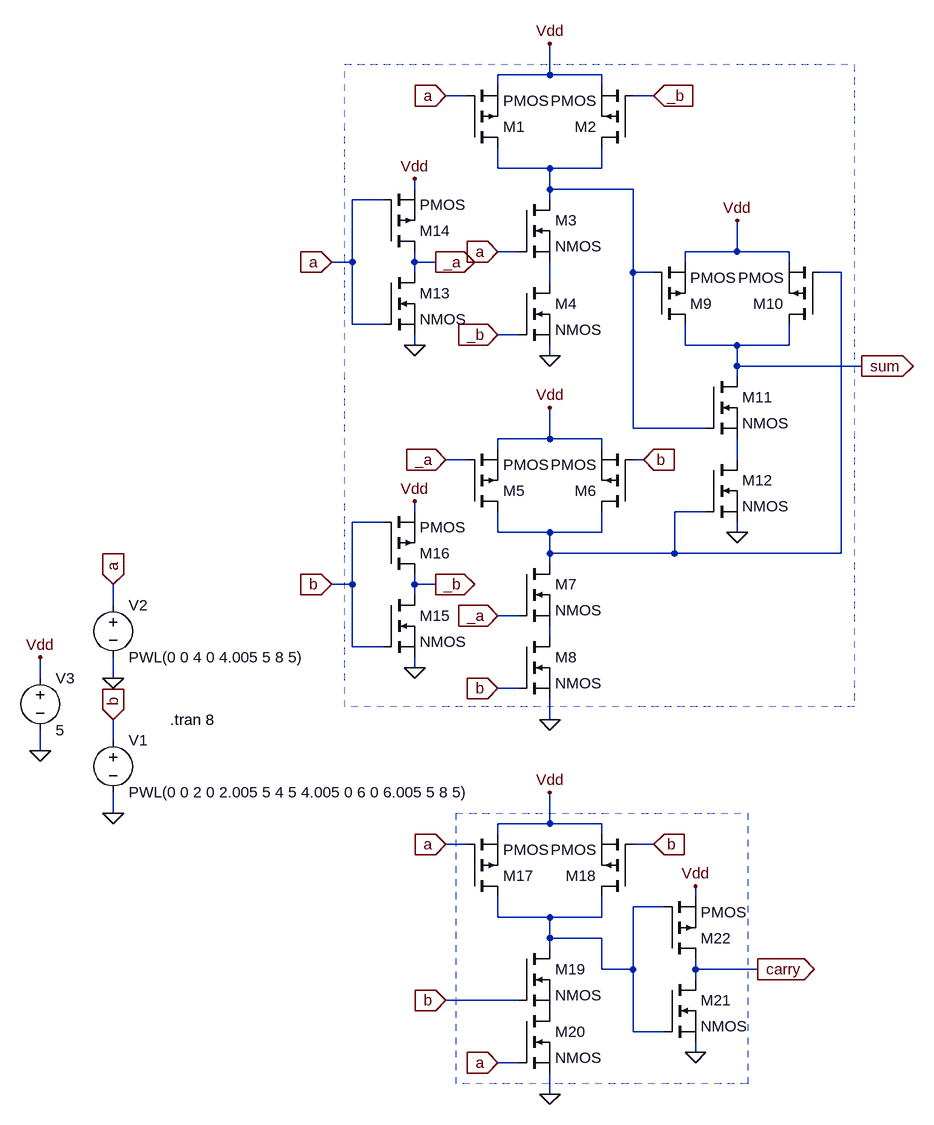
[diagram p0: schematic Half ADDER.asc]
Half ADDER.asc, the LTspice schematic file:
Version 4
SHEET 1 1216 1644
WIRE 304 -208 304 -256
WIRE 304 -208 224 -208
WIRE 384 -208 304 -208
WIRE 224 -192 224 -208
WIRE 384 -192 384 -208
WIRE 176 -176 144 -176
WIRE 464 -176 432 -176
WIRE 224 -64 224 -96
WIRE 304 -64 224 -64
WIRE 384 -64 384 -96
WIRE 384 -64 304 -64
WIRE 96 -32 96 -48
WIRE 304 -32 304 -64
WIRE 432 -32 304 -32
WIRE 48 -16 0 -16
WIRE 304 -16 304 -32
WIRE 256 64 224 64
WIRE 592 64 592 16
WIRE 592 64 512 64
WIRE 672 64 592 64
WIRE 0 80 0 -16
WIRE 0 80 -32 80
WIRE 96 80 96 64
WIRE 128 80 96 80
WIRE 512 80 512 64
WIRE 672 80 672 64
WIRE 96 96 96 80
WIRE 432 96 432 -32
WIRE 464 96 432 96
WIRE 752 96 720 96
WIRE 304 112 304 80
WIRE 0 176 0 80
WIRE 48 176 0 176
WIRE 256 192 224 192
WIRE 96 208 96 192
WIRE 512 208 512 176
WIRE 592 208 512 208
WIRE 672 208 672 176
WIRE 672 208 592 208
WIRE 304 224 304 208
WIRE 592 240 592 208
WIRE 784 240 592 240
WIRE 592 256 592 240
WIRE 432 336 432 96
WIRE 544 336 432 336
WIRE 304 352 304 304
WIRE 304 352 224 352
WIRE 384 352 304 352
WIRE 224 368 224 352
WIRE 384 368 384 352
WIRE 176 384 144 384
WIRE 448 384 432 384
WIRE 592 384 592 352
WIRE 96 464 96 448
WIRE 544 464 496 464
WIRE 48 480 0 480
WIRE 224 496 224 464
WIRE 304 496 224 496
WIRE 384 496 384 464
WIRE 384 496 304 496
WIRE 592 496 592 480
WIRE 304 528 304 496
WIRE 496 528 496 464
WIRE 496 528 304 528
WIRE 752 528 752 96
WIRE 752 528 496 528
WIRE 304 544 304 528
WIRE 0 576 0 480
WIRE 0 576 -32 576
WIRE 96 576 96 560
WIRE 128 576 96 576
WIRE 96 592 96 576
WIRE -368 608 -368 576
WIRE 256 624 224 624
WIRE 304 656 304 640
WIRE 0 672 0 576
WIRE 48 672 0 672
WIRE 96 704 96 688
WIRE -480 720 -480 688
WIRE -368 720 -368 688
WIRE 256 736 224 736
WIRE 304 784 304 752
WIRE -368 816 -368 784
WIRE -480 832 -480 800
WIRE -368 928 -368 896
WIRE 304 944 304 896
WIRE 304 944 224 944
WIRE 384 944 304 944
WIRE 224 960 224 944
WIRE 384 960 384 944
WIRE 176 976 144 976
WIRE 464 976 432 976
WIRE 528 1056 528 1040
WIRE 480 1072 432 1072
WIRE 224 1088 224 1056
WIRE 304 1088 224 1088
WIRE 384 1088 384 1056
WIRE 384 1088 304 1088
WIRE 304 1120 304 1088
WIRE 384 1120 304 1120
WIRE 304 1136 304 1120
WIRE 384 1168 384 1120
WIRE 432 1168 432 1072
WIRE 432 1168 384 1168
WIRE 528 1168 528 1152
WIRE 624 1168 528 1168
WIRE 528 1184 528 1168
WIRE 256 1216 144 1216
WIRE 432 1264 432 1168
WIRE 480 1264 432 1264
WIRE 528 1296 528 1280
WIRE 256 1312 224 1312
WIRE 304 1360 304 1328
FLAG 304 -256 Vdd
FLAG 304 224 0
FLAG 224 192 _b
IOPIN 224 192 In
FLAG 224 64 a
IOPIN 224 64 In
FLAG 144 -176 a
IOPIN 144 -176 In
FLAG 464 -176 _b
IOPIN 464 -176 In
FLAG 304 304 Vdd
FLAG 304 784 0
FLAG 224 736 b
IOPIN 224 736 In
FLAG 224 624 _a
IOPIN 224 624 In
FLAG 144 384 _a
IOPIN 144 384 In
FLAG 448 384 b
IOPIN 448 384 In
FLAG 592 16 Vdd
FLAG 592 496 0
FLAG 784 240 sum
IOPIN 784 240 Out
FLAG 96 208 0
FLAG 96 -48 Vdd
FLAG 128 80 _a
IOPIN 128 80 Out
FLAG -32 80 a
IOPIN -32 80 In
FLAG 96 704 0
FLAG 96 448 Vdd
FLAG 128 576 _b
IOPIN 128 576 Out
FLAG -32 576 b
IOPIN -32 576 In
FLAG -368 928 0
FLAG -368 784 b
IOPIN -368 784 In
FLAG -368 720 0
FLAG -368 576 a
IOPIN -368 576 In
FLAG 304 896 Vdd
FLAG 304 1360 0
FLAG 224 1312 a
IOPIN 224 1312 In
FLAG 144 1216 b
IOPIN 144 1216 In
FLAG 144 976 a
IOPIN 144 976 In
FLAG 464 976 b
IOPIN 464 976 In
FLAG 528 1296 0
FLAG 528 1040 Vdd
FLAG 624 1168 carry
IOPIN 624 1168 Out
FLAG -480 832 0
FLAG -480 688 Vdd
SYMBOL pmos 176 -96 M180
SYMATTR InstName M1
SYMBOL pmos 432 -96 R180
SYMATTR InstName M2
SYMBOL nmos 256 -16 R0
SYMATTR InstName M3
SYMBOL nmos 256 112 R0
SYMATTR InstName M4
SYMBOL pmos 176 464 M180
SYMATTR InstName M5
SYMBOL pmos 432 464 R180
SYMATTR InstName M6
SYMBOL nmos 256 544 R0
SYMATTR InstName M7
SYMBOL nmos 256 656 R0
SYMATTR InstName M8
SYMBOL pmos 464 176 M180
SYMATTR InstName M9
SYMBOL pmos 720 176 R180
SYMATTR InstName M10
SYMBOL nmos 544 256 R0
SYMATTR InstName M11
SYMBOL nmos 544 384 R0
SYMATTR InstName M12
SYMBOL nmos 48 96 R0
SYMATTR InstName M13
SYMBOL pmos 48 64 M180
SYMATTR InstName M14
SYMBOL nmos 48 592 R0
SYMATTR InstName M15
SYMBOL pmos 48 560 M180
SYMATTR InstName M16
SYMBOL voltage -368 800 R0
SYMATTR InstName V1
SYMATTR Value PWL(0 0 2 0 2.005 5 4 5 4.005 0 6 0 6.005 5 8 5)
SYMBOL voltage -368 592 R0
SYMATTR InstName V2
SYMATTR Value PWL(0 0 4 0 4.005 5 8 5)
SYMBOL pmos 176 1056 M180
SYMATTR InstName M17
SYMBOL pmos 432 1056 R180
SYMATTR InstName M18
SYMBOL nmos 256 1136 R0
SYMATTR InstName M19
SYMBOL nmos 256 1232 R0
SYMATTR InstName M20
SYMBOL nmos 480 1184 R0
SYMATTR InstName M21
SYMBOL pmos 480 1152 M180
SYMATTR InstName M22
SYMBOL voltage -480 704 R0
SYMATTR InstName V3
SYMATTR Value 5
TEXT -280 784 Left 2 !.tran 8
RECTANGLE Normal -12 -224 772 764 1
RECTANGLE Normal 160 928 608 1344 2

The netlist it stands for:
* Half ADDER.asc
M1 N001 a Vdd Vdd PMOS
M2 N001 _b Vdd Vdd PMOS
M3 N001 a N003 N003 NMOS
M4 N003 _b 0 0 NMOS
M5 N002 _a Vdd Vdd PMOS
M6 N002 b Vdd Vdd PMOS
M7 N002 _a N005 N005 NMOS
M8 N005 b 0 0 NMOS
M9 sum N001 Vdd Vdd PMOS
M10 sum N002 Vdd Vdd PMOS
M11 sum N001 N004 N004 NMOS
M12 N004 N002 0 0 NMOS
M13 _a a 0 0 NMOS
M14 _a a Vdd Vdd PMOS
M15 _b b 0 0 NMOS
M16 _b b Vdd Vdd PMOS
V1 b 0 PWL(0 0 2 0 2.005 5 4 5 4.005 0 6 0 6.005 5 8 5)
V2 a 0 PWL(0 0 4 0 4.005 5 8 5)
M17 N006 a Vdd Vdd PMOS
M18 N006 b Vdd Vdd PMOS
M19 N006 b P001 P001 NMOS
M20 P001 a 0 0 NMOS
M21 carry N006 0 0 NMOS
M22 carry N006 Vdd Vdd PMOS
V3 Vdd 0 5
.model NMOS NMOS
.model PMOS PMOS
.lib standard.mos
.tran 8
.backanno
.end